# Altium schematic sheet [2]-BLOCK_DIAGRAM.SchDoc
size A4
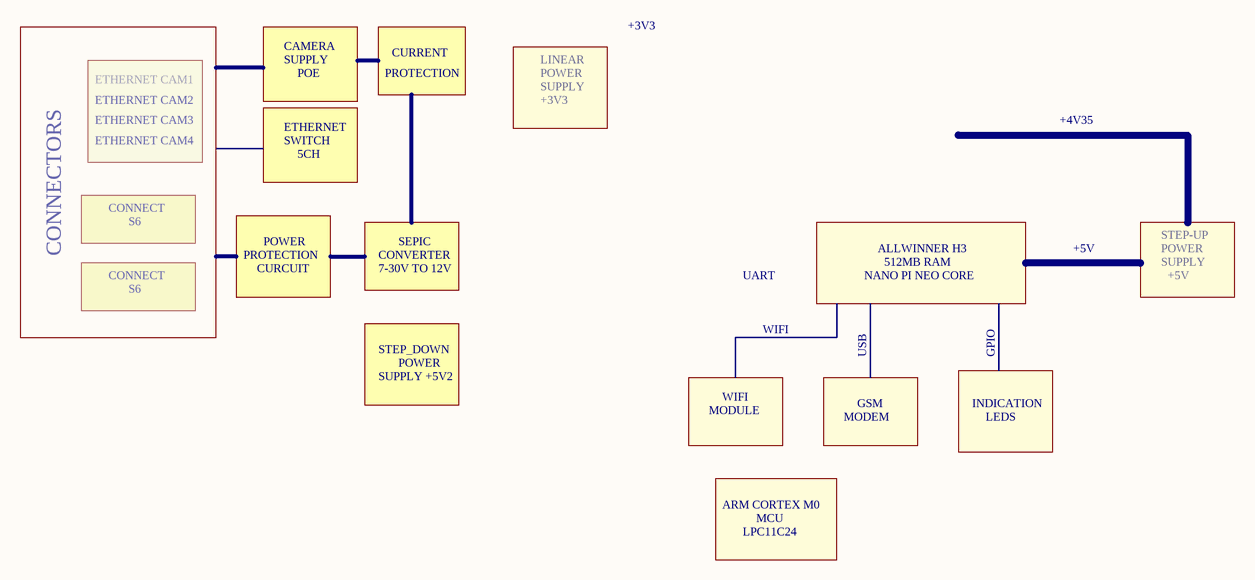
[diagram p0: [2]-BLOCK_DIAGRAM.SchDoc]

## Notes on the sheet
- CAMERA
- SUPPLY
- CURRENT
- LINEAR
- +3V3
- ETHERNET CAM1
- ETHERNET CAM2
- ETHERNET CAM3
- POE
- PROTECTION
- POWER
- +4V35
- ETHERNET CAM4
- ETHERNET
- SWITCH
- 5CH
- CONNECTORS
- CONNECT
- S6
- CONVERTER
- SEPIC
- ALLWINNER H3
- +5V
- STEP-UP
- CURCUIT
- 7-30V TO 12V
- UART
- WIFI
- NANO PI NEO CORE
- 512MB RAM
- SUPPLY +5V2
- STEP_DOWN
- USB
- GPIO
- MODULE
- MODEM
- GSM
- INDICATION
- LEDS
- ARM CORTEX M0
- MCU
- LPC11C24